# Altium schematic sheet FMC.SchDoc
size 420 x 297 mm; SheetNumber: 5; SheetTotal: 7
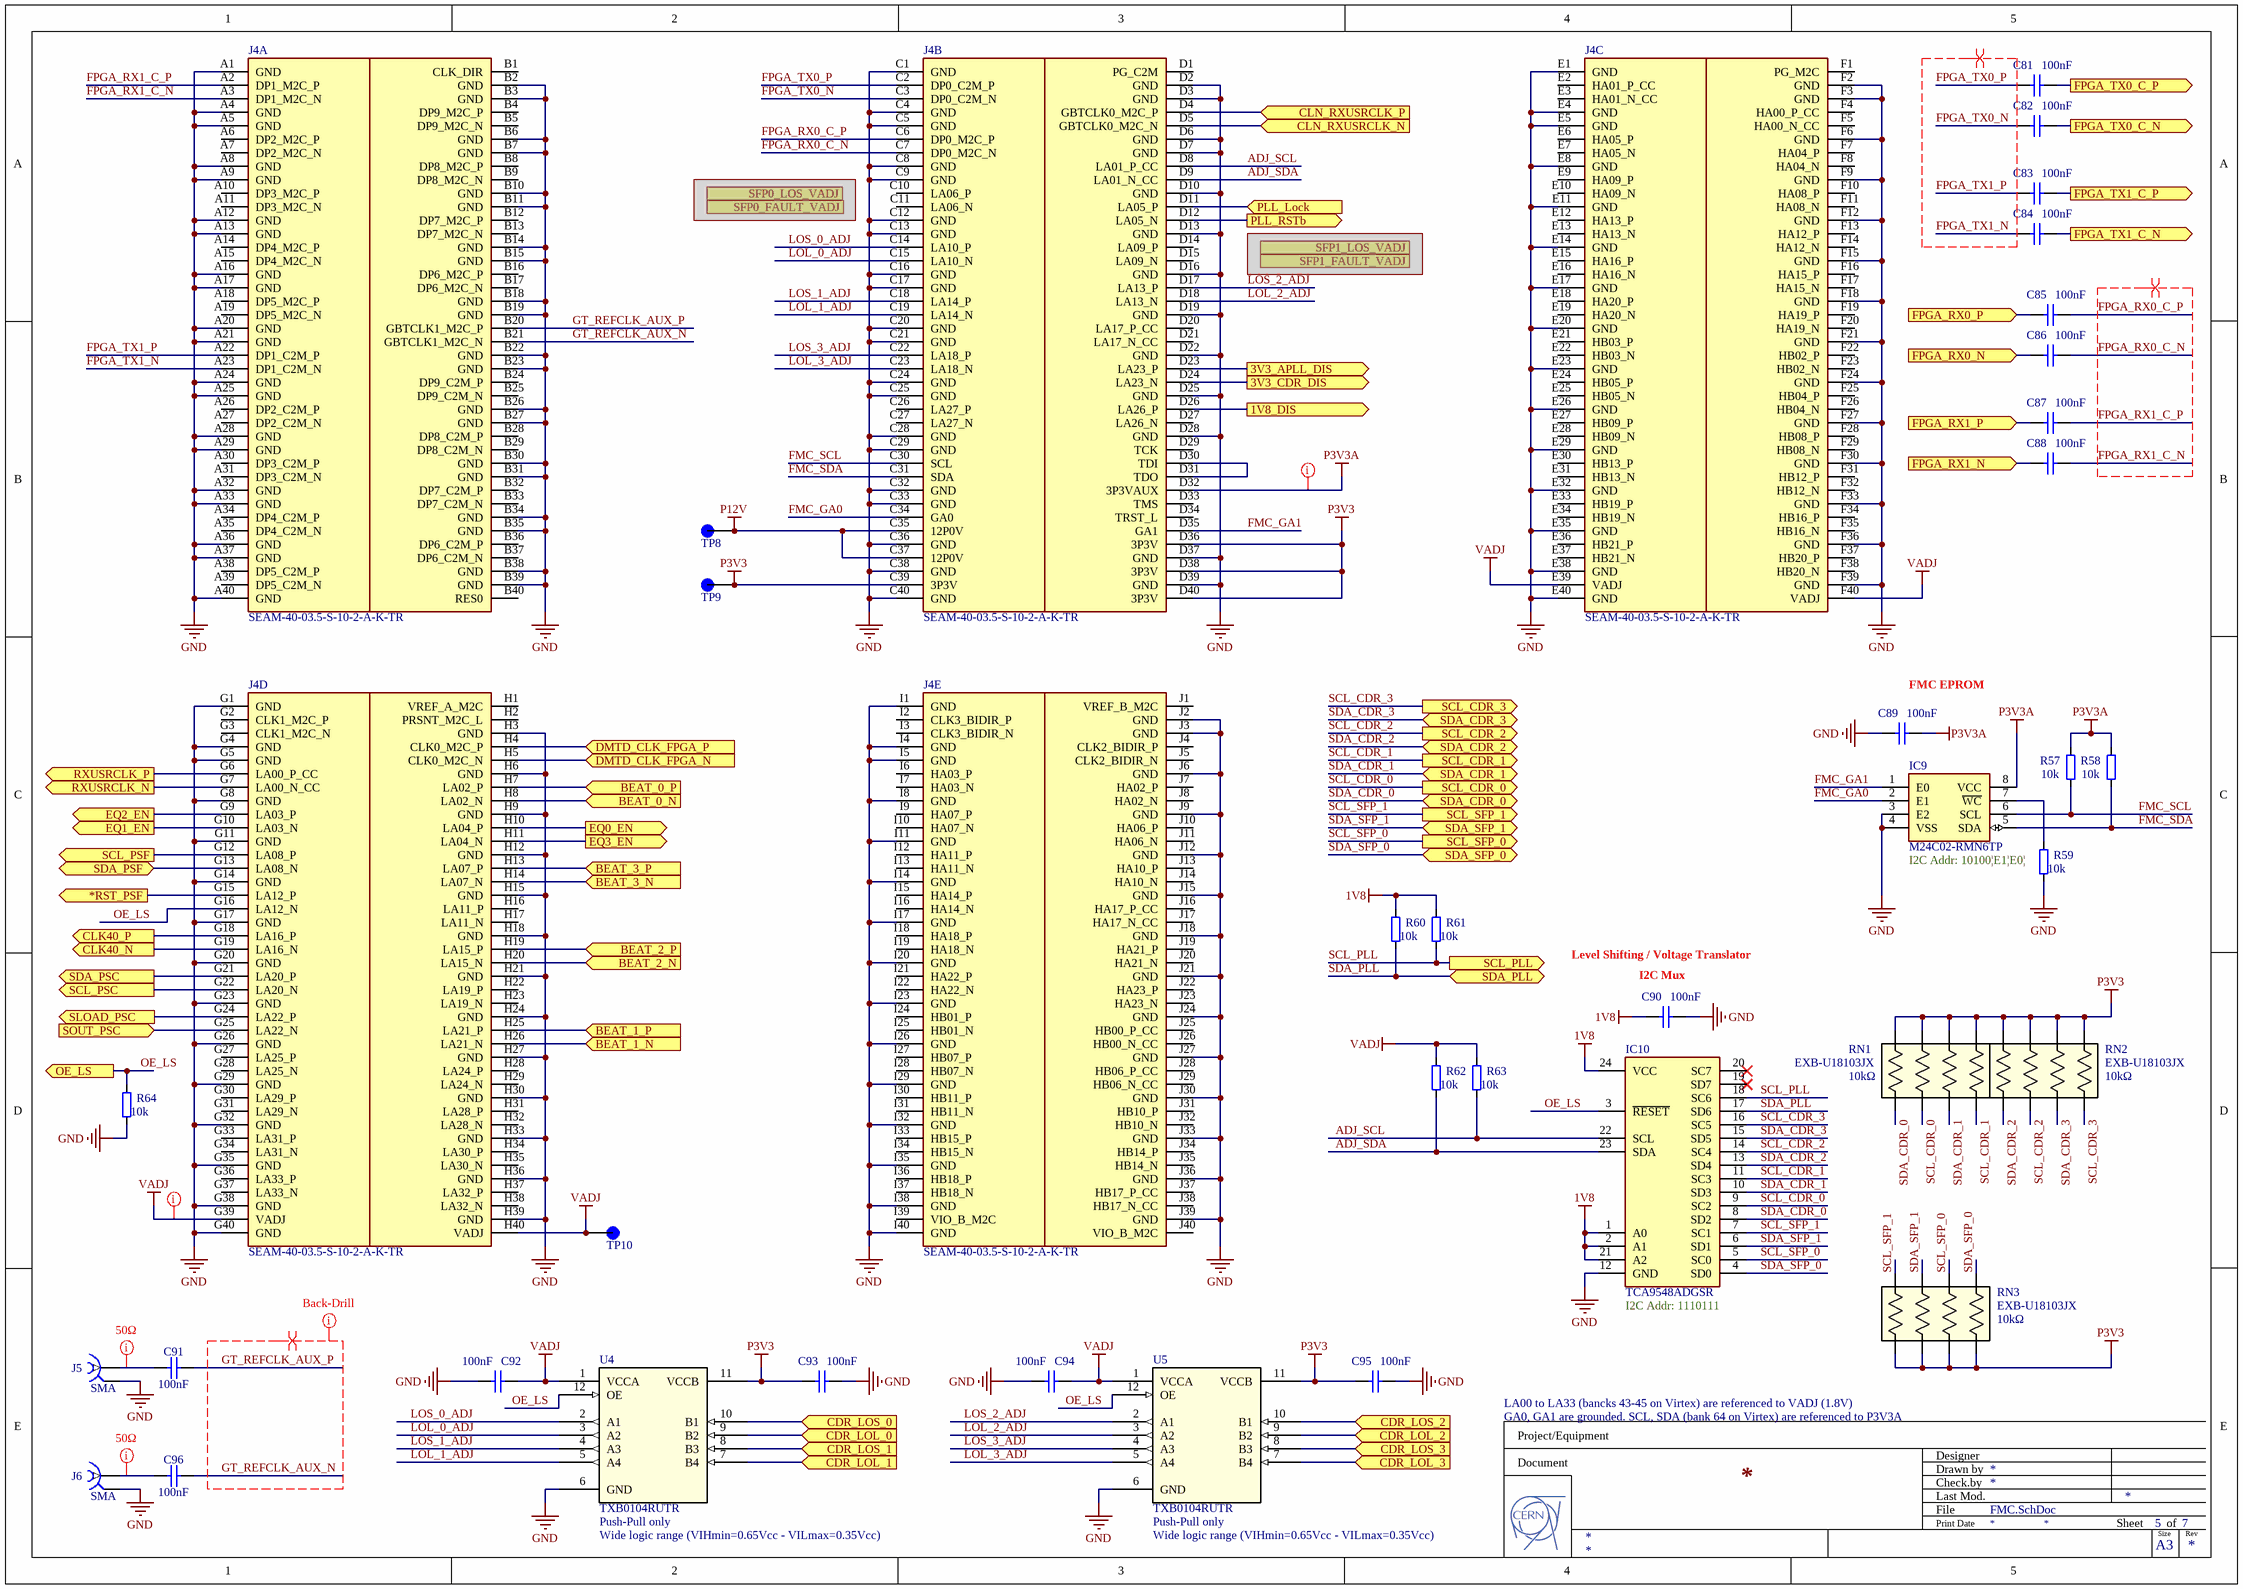
[diagram p0: FMC.SchDoc]

## Parts
C81  100nF  [MURATA_HI_DENSITY_0201]
C82  100nF  [MURATA_HI_DENSITY_0201]
C83  100nF  [MURATA_HI_DENSITY_0201]
C84  100nF  [MURATA_HI_DENSITY_0201]
C85  100nF  [MURATA_HI_DENSITY_0201]
C86  100nF  [MURATA_HI_DENSITY_0201]
C87  100nF  [MURATA_HI_DENSITY_0201]
C88  100nF  [MURATA_HI_DENSITY_0201]
C89  100nF  [MURATA_HI_DENSITY_0201]
C90  100nF  [MURATA_HI_DENSITY_0201]
C91  100nF  [MURATA_HI_DENSITY_0201]
C92  100nF  [MURATA_HI_DENSITY_0201]
C93  100nF  [MURATA_HI_DENSITY_0201]
C94  100nF  [MURATA_HI_DENSITY_0201]
C95  100nF  [MURATA_HI_DENSITY_0201]
C96  100nF  [MURATA_HI_DENSITY_0201]
IC9  M24C02-RMN6TP  [SOIC127P600X175-8N]
IC10  TCA9548ADGSR  [SOP50P490X110-24N]
J4  SEAM-40-03.5-S-10-2-A-K-TR  [SAMTEC_SEAM-40-03.5-S-10-2-A-K-TR]  (parts A,B,C,D,E of 5)
J5  SMA  [SAMTEC_SMA-J-P-H-ST-MT1]
J6  SMA  [SAMTEC_SMA-J-P-H-ST-MT1]
R57  10k  [MURATA_HI_DENSITY_0201]
R58  10k  [MURATA_HI_DENSITY_0201]
R59  10k  [MURATA_HI_DENSITY_0201]
R60  10k  [MURATA_HI_DENSITY_0201]
R61  10k  [MURATA_HI_DENSITY_0201]
R62  10k  [MURATA_HI_DENSITY_0201]
R63  10k  [MURATA_HI_DENSITY_0201]
R64  10k  [MURATA_HI_DENSITY_0201]
RN1  EXB-U18103JX  [EXBU18]
RN2  EXB-U18103JX  [EXBU18]
RN3  EXB-U18103JX  [EXBU18]
TP8  RCU-0C  [TP+195X110]  (value not drawn)
TP9  RCU-0C  [TP+195X110]  (value not drawn)
TP10  RCU-0C  [TP+195X110]  (value not drawn)
U4  TXB0104RUTR  [RUT12_TEX]
U5  TXB0104RUTR  [RUT12_TEX]

## Ports
1V8_DIS (out), 3V3_APLL_DIS (out), 3V3_CDR_DIS (out), *RST_PSF (out), BEAT_0_N (in), BEAT_0_P (in), BEAT_1_N (in), BEAT_1_P (in), BEAT_2_N (in), BEAT_2_P (in), BEAT_3_N (in), BEAT_3_P (in), CDR_LOL_0 (in), CDR_LOL_1 (in), CDR_LOL_2 (in), CDR_LOL_3 (in), CDR_LOS_0 (in), CDR_LOS_1 (in), CDR_LOS_2 (in), CDR_LOS_3 (in), CLK40_N (out), CLK40_P (out), CLN_RXUSRCLK_N (in), CLN_RXUSRCLK_P (in), DMTD_CLK_FPGA_N (in), DMTD_CLK_FPGA_P (in), EQ0_EN (out), EQ1_EN (out), EQ2_EN (out), EQ3_EN (out), FPGA_RX0_N (in), FPGA_RX0_P (in), FPGA_RX1_N (in), FPGA_RX1_P (in), FPGA_TX0_C_N (out), FPGA_TX0_C_P (out), FPGA_TX1_C_N (out), FPGA_TX1_C_P (out), OE_LS (out), PLL_Lock (in), PLL_RSTb (out), RXUSRCLK_N (out), RXUSRCLK_P (out), SCL_CDR_0 (out), SCL_CDR_1 (out), SCL_CDR_2 (out), SCL_CDR_3 (out), SCL_PLL (out), SCL_PSC (out), SCL_PSF (out), SCL_SFP_0 (out), SCL_SFP_1 (out), SDA_CDR_0 (bidir), SDA_CDR_1 (bidir), SDA_CDR_2 (bidir), SDA_CDR_3 (bidir), SDA_PLL (bidir), SDA_PSC (out), SDA_PSF (bidir), SDA_SFP_0 (bidir), SDA_SFP_1 (bidir), SFP0_FAULT_VADJ (in), SFP0_LOS_VADJ (in), SFP1_FAULT_VADJ (in), SFP1_LOS_VADJ (in), SLOAD_PSC (out), SOUT_PSC (in)

## Nets
1V8: C90.2 IC10.1(A0) IC10.2(A1) IC10.21(A2) IC10.24(VCC) R60.2 R61.2
GND: C89.1 C90.1 C92.1 C93.1 C94.1 C95.1 IC9.3(E2) IC9.4(VSS) IC10.12(GND) J4.A1(GND) J4.A4(GND) J4.A5(GND) J4.A8(GND) J4.A9(GND) J4.A12(GND) J4.A13(GND) J4.A16(GND) J4.A17(GND) J4.A20(GND) J4.A21(GND) J4.A24(GND) J4.A25(GND) J4.A28(GND) J4.A29(GND) J4.A32(GND) J4.A33(GND) J4.A36(GND) J4.A37(GND) J4.A40(GND) J4.B2(GND) J4.B3(GND) J4.B6(GND) J4.B7(GND) J4.B10(GND) J4.B11(GND) J4.B14(GND) J4.B15(GND) J4.B18(GND) J4.B19(GND) J4.B22(GND) J4.B23(GND) J4.B26(GND) J4.B27(GND) J4.B30(GND) J4.B31(GND) J4.B34(GND) J4.B35(GND) J4.B38(GND) J4.B39(GND) J4.C1(GND) J4.C4(GND) J4.C5(GND) J4.C8(GND) J4.C9(GND) J4.C12(GND) J4.C13(GND) J4.C16(GND) J4.C17(GND) J4.C20(GND) J4.C21(GND) J4.C24(GND) J4.C25(GND) J4.C28(GND) J4.C29(GND) J4.C32(GND) J4.C33(GND) J4.C36(GND) J4.C38(GND) J4.C40(GND) J4.D2(GND) J4.D3(GND) J4.D6(GND) J4.D7(GND) J4.D10(GND) J4.D13(GND) J4.D16(GND) J4.D19(GND) J4.D22(GND) J4.D25(GND) J4.D28(GND) J4.D37(GND) J4.D39(GND) J4.E1(GND) J4.E4(GND) J4.E5(GND) J4.E8(GND) J4.E11(GND) J4.E14(GND) J4.E17(GND) J4.E20(GND) J4.E23(GND) J4.E26(GND) J4.E29(GND) J4.E32(GND) J4.E35(GND) J4.E38(GND) J4.E40(GND) J4.F2(GND) J4.F3(GND) J4.F6(GND) J4.F9(GND) J4.F12(GND) J4.F15(GND) J4.F18(GND) J4.F21(GND) J4.F24(GND) J4.F27(GND) J4.F30(GND) J4.F33(GND) J4.F36(GND) J4.F39(GND) J4.G1(GND) J4.G4(GND) J4.G5(GND) J4.G8(GND) J4.G11(GND) J4.G14(GND) J4.G17(GND) J4.G20(GND) J4.G23(GND) J4.G26(GND) J4.G29(GND) J4.G32(GND) J4.G35(GND) J4.G38(GND) J4.G40(GND) J4.H3(GND) J4.H6(GND) J4.H9(GND) J4.H12(GND) J4.H15(GND) J4.H18(GND) J4.H21(GND) J4.H24(GND) J4.H27(GND) J4.H30(GND) J4.H33(GND) J4.H36(GND) J4.H39(GND) J4.I1(GND) J4.I4(GND) J4.I5(GND) J4.I8(GND) J4.I11(GND) J4.I14(GND) J4.I17(GND) J4.I20(GND) J4.I23(GND) J4.I26(GND) J4.I29(GND) J4.I32(GND) J4.I35(GND) J4.I38(GND) J4.I40(GND) J4.J2(GND) J4.J3(GND) J4.J6(GND) J4.J9(GND) J4.J12(GND) J4.J15(GND) J4.J18(GND) J4.J21(GND) J4.J24(GND) J4.J27(GND) J4.J30(GND) J4.J33(GND) J4.J36(GND) J4.J39(GND) J5.2 J6.2 R59.1 R64.1 U4.6(GND) U5.6(GND)
P3V3: C93.2 C95.2 J4.C39(3P3V) J4.D36(3P3V) J4.D38(3P3V) J4.D40(3P3V) RN1.5 RN1.6 RN1.7 RN1.8 RN2.5 RN2.6 RN2.7 RN2.8 RN3.1 RN3.2 RN3.3 RN3.4 TP9.1(TP) U4.11(VCCB) U5.11(VCCB)
P3V3A: C89.2 IC9.8(VCC) J4.D32(3P3VAUX) R57.2 R58.2
P12V: J4.C35(12P0V) J4.C37(12P0V) TP8.1(TP)
VADJ: C92.2 C94.2 J4.E39(VADJ) J4.F40(VADJ) J4.G39(VADJ) J4.H40(VADJ) R62.2 R63.2 TP10.1(TP) U4.1(VCCA) U5.1(VCCA)
1V8_DIS: J4.D26(LA26_P) ; port 1V8_DIS
3V3_APLL_DIS: J4.D23(LA23_P) ; port 3V3_APLL_DIS
3V3_CDR_DIS: J4.D24(LA23_N) ; port 3V3_CDR_DIS
*RST_PSF: J4.G15(LA12_P) ; port *RST_PSF
ADJ_SCL: IC10.22(SCL) J4.D8(LA01_P_CC) R63.1
ADJ_SDA: IC10.23(SDA) J4.D9(LA01_N_CC) R62.1
BEAT_0_N: J4.H8(LA02_N) ; port BEAT_0_N
BEAT_0_P: J4.H7(LA02_P) ; port BEAT_0_P
BEAT_1_N: J4.H26(LA21_N) ; port BEAT_1_N
BEAT_1_P: J4.H25(LA21_P) ; port BEAT_1_P
BEAT_2_N: J4.H20(LA15_N) ; port BEAT_2_N
BEAT_2_P: J4.H19(LA15_P) ; port BEAT_2_P
BEAT_3_N: J4.H14(LA07_N) ; port BEAT_3_N
BEAT_3_P: J4.H13(LA07_P) ; port BEAT_3_P
CDR_LOL_0: U4.9(B2) ; port CDR_LOL_0
CDR_LOL_1: U4.7(B4) ; port CDR_LOL_1
CDR_LOL_2: U5.9(B2) ; port CDR_LOL_2
CDR_LOL_3: U5.7(B4) ; port CDR_LOL_3
CDR_LOS_0: U4.10(B1) ; port CDR_LOS_0
CDR_LOS_1: U4.8(B3) ; port CDR_LOS_1
CDR_LOS_2: U5.10(B1) ; port CDR_LOS_2
CDR_LOS_3: U5.8(B3) ; port CDR_LOS_3
CLK40_N: J4.G19(LA16_N) ; port CLK40_N
CLK40_P: J4.G18(LA16_P) ; port CLK40_P
CLN_RXUSRCLK_N: J4.D5(GBTCLK0_M2C_N) ; port CLN_RXUSRCLK_N
CLN_RXUSRCLK_P: J4.D4(GBTCLK0_M2C_P) ; port CLN_RXUSRCLK_P
DMTD_CLK_FPGA_N: J4.H5(CLK0_M2C_N) ; port DMTD_CLK_FPGA_N
DMTD_CLK_FPGA_P: J4.H4(CLK0_M2C_P) ; port DMTD_CLK_FPGA_P
EQ0_EN: J4.H10(LA04_P) ; port EQ0_EN
EQ1_EN: J4.G10(LA03_N) ; port EQ1_EN
EQ2_EN: J4.G9(LA03_P) ; port EQ2_EN
EQ3_EN: J4.H11(LA04_N) ; port EQ3_EN
FMC_GA0: IC9.2(E1) J4.C34(GA0)
FMC_GA1: IC9.1(E0) J4.D35(GA1)
FMC_SCL: IC9.6(SCL) J4.C30(SCL) R57.1
FMC_SDA: IC9.5(SDA) J4.C31(SDA) R58.1
FPGA_RX0_C_N: C86.1 J4.C7(DP0_M2C_N)
FPGA_RX0_C_P: C85.1 J4.C6(DP0_M2C_P)
FPGA_RX0_N: C86.2 ; port FPGA_RX0_N
FPGA_RX0_P: C85.2 ; port FPGA_RX0_P
FPGA_RX1_C_N: C88.1 J4.A3(DP1_M2C_N)
FPGA_RX1_C_P: C87.1 J4.A2(DP1_M2C_P)
FPGA_RX1_N: C88.2 ; port FPGA_RX1_N
FPGA_RX1_P: C87.2 ; port FPGA_RX1_P
FPGA_TX0_C_N: C82.1 ; port FPGA_TX0_C_N
FPGA_TX0_C_P: C81.1 ; port FPGA_TX0_C_P
FPGA_TX0_N: C82.2 J4.C3(DP0_C2M_N)
FPGA_TX0_P: C81.2 J4.C2(DP0_C2M_P)
FPGA_TX1_C_N: C84.1 ; port FPGA_TX1_C_N
FPGA_TX1_C_P: C83.1 ; port FPGA_TX1_C_P
FPGA_TX1_N: C84.2 J4.A23(DP1_C2M_N)
FPGA_TX1_P: C83.2 J4.A22(DP1_C2M_P)
GT_REFCLK_AUX_N: C96.1 J4.B21(GBTCLK1_M2C_N)
GT_REFCLK_AUX_P: C91.1 J4.B20(GBTCLK1_M2C_P)
LOL_0_ADJ: J4.C15(LA10_N) U4.3(A2)
LOL_1_ADJ: J4.C19(LA14_N) U4.5(A4)
LOL_2_ADJ: J4.D18(LA13_N) U5.3(A2)
LOL_3_ADJ: J4.C23(LA18_N) U5.5(A4)
LOS_0_ADJ: J4.C14(LA10_P) U4.2(A1)
LOS_1_ADJ: J4.C18(LA14_P) U4.4(A3)
LOS_2_ADJ: J4.D17(LA13_P) U5.2(A1)
LOS_3_ADJ: J4.C22(LA18_P) U5.4(A3)
OE_LS: IC10.3(~{RESET}) J4.G16(LA12_N) R64.2 U4.12(OE) U5.12(OE) ; port OE_LS
PLL_Lock: J4.D11(LA05_P) ; port PLL_Lock
PLL_RSTb: J4.D12(LA05_N) ; port PLL_RSTb
RXUSRCLK_N: J4.G7(LA00_N_CC) ; port RXUSRCLK_N
RXUSRCLK_P: J4.G6(LA00_P_CC) ; port RXUSRCLK_P
SCL_CDR_0: IC10.9(SC2) RN1.2 ; port SCL_CDR_0
SCL_CDR_1: IC10.11(SC3) RN1.4 ; port SCL_CDR_1
SCL_CDR_2: IC10.14(SC4) RN2.2 ; port SCL_CDR_2
SCL_CDR_3: IC10.16(SC5) RN2.4 ; port SCL_CDR_3
SCL_PLL: IC10.18(SC6) R61.1 ; port SCL_PLL
SCL_PSC: J4.G22(LA20_N) ; port SCL_PSC
SCL_PSF: J4.G12(LA08_P) ; port SCL_PSF
SCL_SFP_0: IC10.5(SC0) RN3.6 ; port SCL_SFP_0
SCL_SFP_1: IC10.7(SC1) RN3.8 ; port SCL_SFP_1
SDA_CDR_0: IC10.8(SD2) RN1.1 ; port SDA_CDR_0
SDA_CDR_1: IC10.10(SD3) RN1.3 ; port SDA_CDR_1
SDA_CDR_2: IC10.13(SD4) RN2.1 ; port SDA_CDR_2
SDA_CDR_3: IC10.15(SD5) RN2.3 ; port SDA_CDR_3
SDA_PLL: IC10.17(SD6) R60.1 ; port SDA_PLL
SDA_PSC: J4.G21(LA20_P) ; port SDA_PSC
SDA_PSF: J4.G13(LA08_N) ; port SDA_PSF
SDA_SFP_0: IC10.4(SD0) RN3.5 ; port SDA_SFP_0
SDA_SFP_1: IC10.6(SD1) RN3.7 ; port SDA_SFP_1
SLOAD_PSC: J4.G24(LA22_P) ; port SLOAD_PSC
SOUT_PSC: J4.G25(LA22_N) ; port SOUT_PSC
NetC91_2: C91.2 J5.1
NetC96_2: C96.2 J6.1
NetIC9_7: IC9.7(~{WC}) R59.2
NetJ4_D30: J4.D30(TDI) J4.D31(TDO)

Not connected (* = marked no-connect by the designer): IC10 19(SD7)* 20(SC7)*; J4 A6(DP2_M2C_P) A7(DP2_M2C_N) A10(DP3_M2C_P) A11(DP3_M2C_N) A14(DP4_M2C_P) A15(DP4_M2C_N) A18(DP5_M2C_P) A19(DP5_M2C_N) A26(DP2_C2M_P) A27(DP2_C2M_N) A30(DP3_C2M_P) A31(DP3_C2M_N) A34(DP4_C2M_P) A35(DP4_C2M_N) A38(DP5_C2M_P) A39(DP5_C2M_N) B1(CLK_DIR) B4(DP9_M2C_P) B5(DP9_M2C_N) B8(DP8_M2C_P) B9(DP8_M2C_N) B12(DP7_M2C_P) B13(DP7_M2C_N) B16(DP6_M2C_P) B17(DP6_M2C_N) B24(DP9_C2M_P) B25(DP9_C2M_N) B28(DP8_C2M_P) B29(DP8_C2M_N) B32(DP7_C2M_P) B33(DP7_C2M_N) B36(DP6_C2M_P) B37(DP6_C2M_N) B40(RES0) C10(LA06_P) C11(LA06_N) C26(LA27_P) C27(LA27_N) D1(PG_C2M) D14(LA09_P) D15(LA09_N) D20(LA17_P_CC) D21(LA17_N_CC) D27(LA26_N) D29(TCK) D33(TMS) D34(TRST_L) E2(HA01_P_CC) E3(HA01_N_CC) E6(HA05_P) E7(HA05_N) E9(HA09_P) E10(HA09_N) E12(HA13_P) E13(HA13_N) E15(HA16_P) E16(HA16_N) E18(HA20_P) E19(HA20_N) E21(HB03_P) E22(HB03_N) E24(HB05_P) E25(HB05_N) E27(HB09_P) E28(HB09_N) E30(HB13_P) E31(HB13_N) E33(HB19_P) E34(HB19_N) E36(HB21_P) E37(HB21_N) F1(PG_M2C) F4(HA00_P_CC) F5(HA00_N_CC) F7(HA04_P) F8(HA04_N) F10(HA08_P) F11(HA08_N) F13(HA12_P) F14(HA12_N) F16(HA15_P) F17(HA15_N) F19(HA19_P) F20(HA19_N) F22(HB02_P) F23(HB02_N) F25(HB04_P) F26(HB04_N) F28(HB08_P) F29(HB08_N) F31(HB12_P) F32(HB12_N) F34(HB16_P) F35(HB16_N) F37(HB20_P) F38(HB20_N) G2(CLK1_M2C_P) G3(CLK1_M2C_N) G27(LA25_P) G28(LA25_N) G30(LA29_P) G31(LA29_N) G33(LA31_P) G34(LA31_N) G36(LA33_P) G37(LA33_N) H1(VREF_A_M2C) H2(PRSNT_M2C_L) H16(LA11_P) H17(LA11_N) H22(LA19_P) H23(LA19_N) H28(LA24_P) H29(LA24_N) H31(LA28_P) H32(LA28_N) H34(LA30_P) H35(LA30_N) H37(LA32_P) H38(LA32_N) I2(CLK3_BIDIR_P) I3(CLK3_BIDIR_N) I6(HA03_P) I7(HA03_N) I9(HA07_P) I10(HA07_N) I12(HA11_P) I13(HA11_N) I15(HA14_P) I16(HA14_N) I18(HA18_P) I19(HA18_N) I21(HA22_P) I22(HA22_N) I24(HB01_P) I25(HB01_N) I27(HB07_P) I28(HB07_N) I30(HB11_P) I31(HB11_N) I33(HB15_P) I34(HB15_N) I36(HB18_P) I37(HB18_N) I39(VIO_B_M2C) J1(VREF_B_M2C) J4(CLK2_BIDIR_P) J5(CLK2_BIDIR_N) J7(HA02_P) J8(HA02_N) J10(HA06_P) J11(HA06_N) J13(HA10_P) J14(HA10_N) J16(HA17_P_CC) J17(HA17_N_CC) J19(HA21_P) J20(HA21_N) J22(HA23_P) J23(HA23_N) J25(HB00_P_CC) J26(HB00_N_CC) J28(HB06_P_CC) J29(HB06_N_CC) J31(HB10_P) J32(HB10_N) J34(HB14_P) J35(HB14_N) J37(HB17_P_CC) J38(HB17_N_CC) J40(VIO_B_M2C)

## Layout directives
differential pair: FPGA_RX0_C_N, FPGA_RX0_C_P, FPGA_RX1_C_N, FPGA_RX1_C_P, FPGA_TX0_N, FPGA_TX0_P, FPGA_TX1_N, FPGA_TX1_P, GT_REFCLK_AUX_N, GT_REFCLK_AUX_P
net class Back-Drill: GT_REFCLK_AUX_N, GT_REFCLK_AUX_P
net class Power: P3V3A, VADJ
net class 50ohm: NetC91_2, NetC96_2

## Notes on the sheet
- (near C89) FMC EPROM
- (near R59) I2C Addr: 10100|E1|E0|
- Level Shifting / Voltage Translator
- (near C90) I2C Mux
- (near RN1) 10kΩ
- (near RN2) 10kΩ
- (near IC10) I2C Addr: 1110111
- (near RN3) 10kΩ
- LA00 to LA33 (bancks 43-45 on Virtex) are referenced to VADJ (1.8V)
  GA0, GA1 are grounded. SCL, SDA (bank 64 on Virtex) are referenced to P3V3A
- (near U4) Push-Pull only
- (near U4) Wide logic range (VIHmin=0.65Vcc - VILmax=0.35Vcc)
- (near U5) Push-Pull only
- (near U5) Wide logic range (VIHmin=0.65Vcc - VILmax=0.35Vcc)
- Project/Equipment
- Document
- Designer
- Drawn by
- Check.by
- File
- Last Mod.
- Print Date
- Sheet
- Size
- A3
- of
- Rev

## Library data of the parts
C81-C96 = C0201-100nF-high-density: GRM033R61C104KE14; Vmax: 16V; Value: 100nF
IC9 = M24C02-RMN6TP: Integrated Circuit; Manufacturer_Name: STMicroelectronics; Datasheet Link: http://www.st.com/st-web-ui/static/active/en/resource/technical/document/datasheet/DM00071904.pdf; Height: 1.75mm; Manufacturer_Part_Number: M24C02-RMN6TP; Mouser Part Number: 511-M24C02-RMN6TP; Mouser Price/Stock: https://www.mouser.co.uk/ProductDetail/STMicroelectronics/M24C02-RMN6TP?qs=Jodr3Ka7a6ktinv3aZzndw%3D%3D; Arrow Part Number: M24C02-RMN6TP; Arrow Price/Stock: https://www.arrow.com/en/products/m24c02-rmn6tp/stmicroelectronics?region=nac
IC10 = TCA9548ADGSR: Integrated Circuit; Manufacturer_Name: Texas Instruments; Datasheet Link: https://www.ti.com/lit/ds/symlink/tca9548a.pdf?ts=1738746169750&ref_url=https%253A%252F%252Fwww.mouser.de%252F; Height: 1.1mm; Manufacturer_Part_Number: TCA9548ADGSR; Mouser Part Number: 595-TCA9548ADGSR; Mouser Price/Stock: https://www.mouser.co.uk/ProductDetail/Texas-Instruments/TCA9548ADGSR?qs=olJun0bQHM%252B7USbLxm4jDw%3D%3D; Arrow Part Number: TCA9548ADGSR; Arrow Price/Stock: https://www.arrow.com/en/products/tca9548adgsr/texas-instruments?utm_currency=USD&region=nac
J4 = SEAM-40-03.5-S-10-2-A-K-TR: MF: Samtec; Value: *; Package: None; Price: None; MP: SEAM-40-03.5-S-10-2-A-K-TR; Availability: Unavailable
J5 J6 = SAMTEC_SMA-J-P-H-ST-MT1: Part Description: 50 Ohms SMA Straight Mixed Technology PCB Jack; Manufacturer: SAMTEC; PressFit: No; Sense Comment: assembly limitations; Part Number: SAMTEC_SMA-J-P-H-ST-MT1; Component Kind: Standard; Component Type: Standard; Pin Count: 5; Family: SMA; Mounted: Yes; Socket: No; SMD: Yes; Sense: Yes; Status: Not Recommended; Manufacturer Part Number: SMA-J-P-H-ST-MT1; ComponentHeight: 7.95mm; HelpURL: \\cern.ch\dfs\Applications\Altium\Datasheets\SAMTEC_SMA-J-P-H-ST-MT1.pdf; Author: CERN DEM HF; CreateDate: 5/24/2023; LatestRevisionDate: 5/24/2023
R57-R64 = R0201-100ohm-high-density: Resistor 10k; Value: 100Ω
RN1-RN3 = EXB-U18103JX: Resistor Network (8-Pin) 10k; Manufacturer_Name: Panasonic; Datasheet Link: https://industrial.panasonic.com/cdbs/www-data/pdf/AOC0000/AOC0000C20.pdf; Height: 0.45mm; Manufacturer_Part_Number: EXB-U18103JX; Mouser Part Number: 667-EXB-U18103JX; Mouser Price/Stock: https://www.mouser.com/Search/Refine.aspx?Keyword=667-EXB-U18103JX
TP8-TP10 = RCU-0C: MF: {'manufacturer': u'TE Connectivity AMP Connectors'}; Package: None; Price: None; Value: *; MP: RCU-0C; Availability: Unavailable
U4 U5 = TXB0104RUTR: No Description Available; Mfr_Name: Texas Instruments; RefDes: RefDes; Type: Type